# EAGLE design tactile_sensor_master_v1.1 (EAGLE 9.7.0)
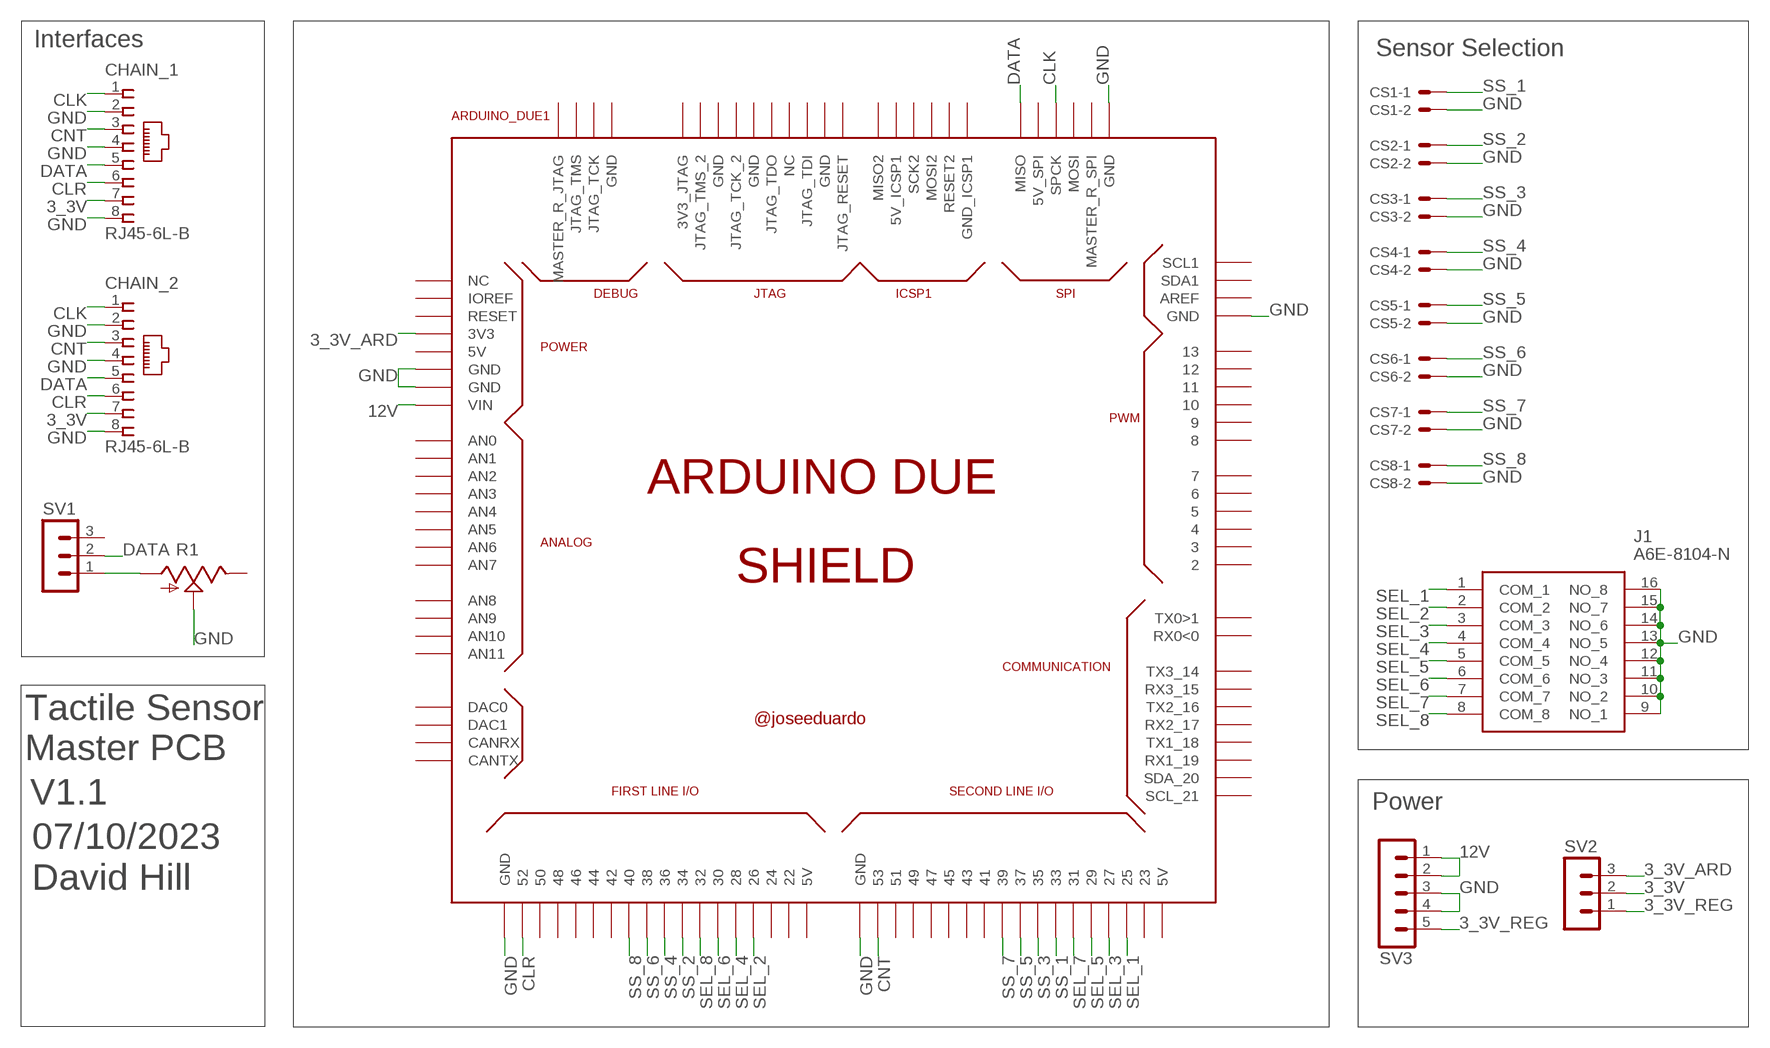
[diagram p0: schematic, sheet 1]

## Parts
ARDUINO_DUE1  ARDUINO_DUE_SHIELD  [ARDUINO_DUE_SHIELD]
CHAIN_1  RJ45-6L-B  [RJ45-NO-SHIELD]
CHAIN_2  RJ45-6L-B  [RJ45-NO-SHIELD]
CS1  22-23-2021  [22-23-2021]
CS2  22-23-2021  [22-23-2021]
CS3  22-23-2021  [22-23-2021]
CS4  22-23-2021  [22-23-2021]
CS5  22-23-2021  [22-23-2021]
CS6  22-23-2021  [22-23-2021]
CS7  22-23-2021  [22-23-2021]
CS8  22-23-2021  [22-23-2021]
J1  A6E-8104-N  [A6E8104N]
R1  TRIM_US-B25P  [B25P]
SV1  MA03-1  [MA03-1]
SV2  MA03-1  [MA03-1]
SV3  MA05-1  [MA05-1]

## Nets
3_3V: CHAIN_1.7 CHAIN_2.7 SV2.2
3_3V_ARD: ARDUINO_DUE1.3V3 SV2.3
3_3V_REG: SV2.1 SV3.5
12V: ARDUINO_DUE1.VIN SV3.1 SV3.2
CLK: ARDUINO_DUE1.SPCK CHAIN_1.1 CHAIN_2.1
CLR: ARDUINO_DUE1.52 CHAIN_1.6 CHAIN_2.6
CNT: ARDUINO_DUE1.53 CHAIN_1.3 CHAIN_2.3
DATA: ARDUINO_DUE1.MISO CHAIN_1.5 CHAIN_2.5 SV1.2
GND: ARDUINO_DUE1.GND ARDUINO_DUE1.GND_1(GND) ARDUINO_DUE1.GND_2(GND) ARDUINO_DUE1.GND_3(GND) ARDUINO_DUE1.GND_4(GND) ARDUINO_DUE1.GND_5(GND) CHAIN_1.2 CHAIN_1.4 CHAIN_1.8 CHAIN_2.2 CHAIN_2.4 CHAIN_2.8 CS1.2 CS2.2 CS3.2 CS4.2 CS5.2 CS6.2 CS7.2 CS8.2 J1.9(NO_1) J1.10(NO_2) J1.11(NO_3) J1.12(NO_4) J1.13(NO_5) J1.14(NO_6) J1.15(NO_7) J1.16(NO_8) R1.S SV3.3 SV3.4
N$1: R1.A SV1.1
SEL_1: ARDUINO_DUE1.25 J1.1(COM_1)
SEL_2: ARDUINO_DUE1.26 J1.2(COM_2)
SEL_3: ARDUINO_DUE1.27 J1.3(COM_3)
SEL_4: ARDUINO_DUE1.28 J1.4(COM_4)
SEL_5: ARDUINO_DUE1.29 J1.5(COM_5)
SEL_6: ARDUINO_DUE1.30 J1.6(COM_6)
SEL_7: ARDUINO_DUE1.31 J1.7(COM_7)
SEL_8: ARDUINO_DUE1.32 J1.8(COM_8)
SS_1: ARDUINO_DUE1.33 CS1.1
SS_2: ARDUINO_DUE1.34 CS2.1
SS_3: ARDUINO_DUE1.35 CS3.1
SS_4: ARDUINO_DUE1.36 CS4.1
SS_5: ARDUINO_DUE1.37 CS5.1
SS_6: ARDUINO_DUE1.38 CS6.1
SS_7: ARDUINO_DUE1.39 CS7.1
SS_8: ARDUINO_DUE1.40 CS8.1
Unconnected: ARDUINO_DUE1.0(RX0<0) ARDUINO_DUE1.1(TX0>1) ARDUINO_DUE1.2 ARDUINO_DUE1.3 ARDUINO_DUE1.3V3_JTAG ARDUINO_DUE1.4 ARDUINO_DUE1.5 ARDUINO_DUE1.5V0(5V) ARDUINO_DUE1.5V0_1(5V) ARDUINO_DUE1.5V0_2(5V) ARDUINO_DUE1.5V_2(5V_SPI) ARDUINO_DUE1.5V_ICSP1 ARDUINO_DUE1.6 ARDUINO_DUE1.7 ARDUINO_DUE1.8 ARDUINO_DUE1.9 ARDUINO_DUE1.10 ARDUINO_DUE1.11 ARDUINO_DUE1.12 ARDUINO_DUE1.13 ARDUINO_DUE1.14(TX3_14) ARDUINO_DUE1.15(RX3_15) ARDUINO_DUE1.16(TX2_16) ARDUINO_DUE1.17(RX2_17) ARDUINO_DUE1.18(TX1_18) ARDUINO_DUE1.19(RX1_19) ARDUINO_DUE1.20(SDA_20) ARDUINO_DUE1.21(SCL_21) ARDUINO_DUE1.22 ARDUINO_DUE1.23 ARDUINO_DUE1.24 ARDUINO_DUE1.41 ARDUINO_DUE1.42 ARDUINO_DUE1.43 ARDUINO_DUE1.44 ARDUINO_DUE1.45 ARDUINO_DUE1.46 ARDUINO_DUE1.47 ARDUINO_DUE1.48 ARDUINO_DUE1.49 ARDUINO_DUE1.50 ARDUINO_DUE1.51 ARDUINO_DUE1.A0(AN0) ARDUINO_DUE1.A1(AN1) ARDUINO_DUE1.A2(AN2) ARDUINO_DUE1.A3(AN3) ARDUINO_DUE1.A4(AN4) ARDUINO_DUE1.A5(AN5) ARDUINO_DUE1.A6(AN6) ARDUINO_DUE1.A7(AN7) ARDUINO_DUE1.A8(AN8) ARDUINO_DUE1.A9(AN9) ARDUINO_DUE1.A10(AN10) ARDUINO_DUE1.A11(AN11) ARDUINO_DUE1.AREF ARDUINO_DUE1.CANRX ARDUINO_DUE1.CANTX ARDUINO_DUE1.DAC0 ARDUINO_DUE1.DAC1 ARDUINO_DUE1.GND_7(GND) ARDUINO_DUE1.GND_8(GND) ARDUINO_DUE1.GND_9(GND) ARDUINO_DUE1.GND_10(GND) ARDUINO_DUE1.GND_ICSP1 ARDUINO_DUE1.IOREF ARDUINO_DUE1.JTAG_RESET ARDUINO_DUE1.JTAG_TCK ARDUINO_DUE1.JTAG_TCK_2 ARDUINO_DUE1.JTAG_TDI ARDUINO_DUE1.JTAG_TDO ARDUINO_DUE1.JTAG_TMS ARDUINO_DUE1.JTAG_TMS_2 ARDUINO_DUE1.MASTER_RESET_JTAG(MASTER_R_JTAG) ARDUINO_DUE1.MASTER_RESET_SPI(MASTER_R_SPI) ARDUINO_DUE1.MISO2 ARDUINO_DUE1.MOSI ARDUINO_DUE1.MOSI2 ARDUINO_DUE1.NC_2(NC) ARDUINO_DUE1.NC_5(NC) ARDUINO_DUE1.RESET ARDUINO_DUE1.RESET2 ARDUINO_DUE1.SCK2 ARDUINO_DUE1.SCL1 ARDUINO_DUE1.SDA1 R1.E SV1.3

## Notes on the sheet
- Interfaces
- Sensor Selection
- Tactile Sensor
  Master PCB
- V1.1 | Power
- 07/10/2023
- David Hill

## Library data of the parts
ARDUINO_DUE1 = arduino_due_shield:ARDUINO_DUE_SHIELD
CHAIN_1 CHAIN_2 = con-tycoelectronics:RJ45: CORCOM Modular RJ Jacks No Shield Source: www.tycoelectronics.com .. ENG_DS_1654001_1099_RJ_L_0507.pdf; MPN: RJ45-6L-B; OC_FARNELL: unknown; OC_NEWARK: 16R6090
CS1-CS8 = con-molex:22-23-2021: .100" (2.54mm) Center Header - 2 Pin; MF: MOLEX; MPN: 22-23-2021; OC_FARNELL: 1462926; OC_NEWARK: 25C3832
J1 = SamacSys_Parts:A6E-8104-N: OMRON ELECTRONIC COMPONENTS - A6E-8104-N - DIP SWITCH, 8POS, SPST, RAISED Source: Datasheet <https://www.mouser.com/datasheet/2/307/en-a6en-770042.pdf>; DESCRIPTION: OMRON ELECTRONIC COMPONENTS - A6E-8104-N - DIP SWITCH, 8POS, SPST, RAISED; HEIGHT: 7.5mm; MANUFACTURER_NAME: Omron Electronics; MANUFACTURER_PART_NUMBER: A6E-8104-N; MOUSER_PART_NUMBER: 653-A6E8104N; MOUSER_PRICE-STOCK: https://www.mouser.co.uk/ProductDetail/Omron-Electronics/A6E-8104-N?qs=vyIerDHf%2FmloJqQ30NZRaQ%3D%3D
R1 = pot:TRIM_US-: POTENTIOMETER
SV1 SV2 = con-lstb:MA03-1: PIN HEADER; OC_FARNELL: unknown; OC_NEWARK: unknown
SV3 = con-lstb:MA05-1: PIN HEADER; OC_FARNELL: unknown; OC_NEWARK: unknown

## Board
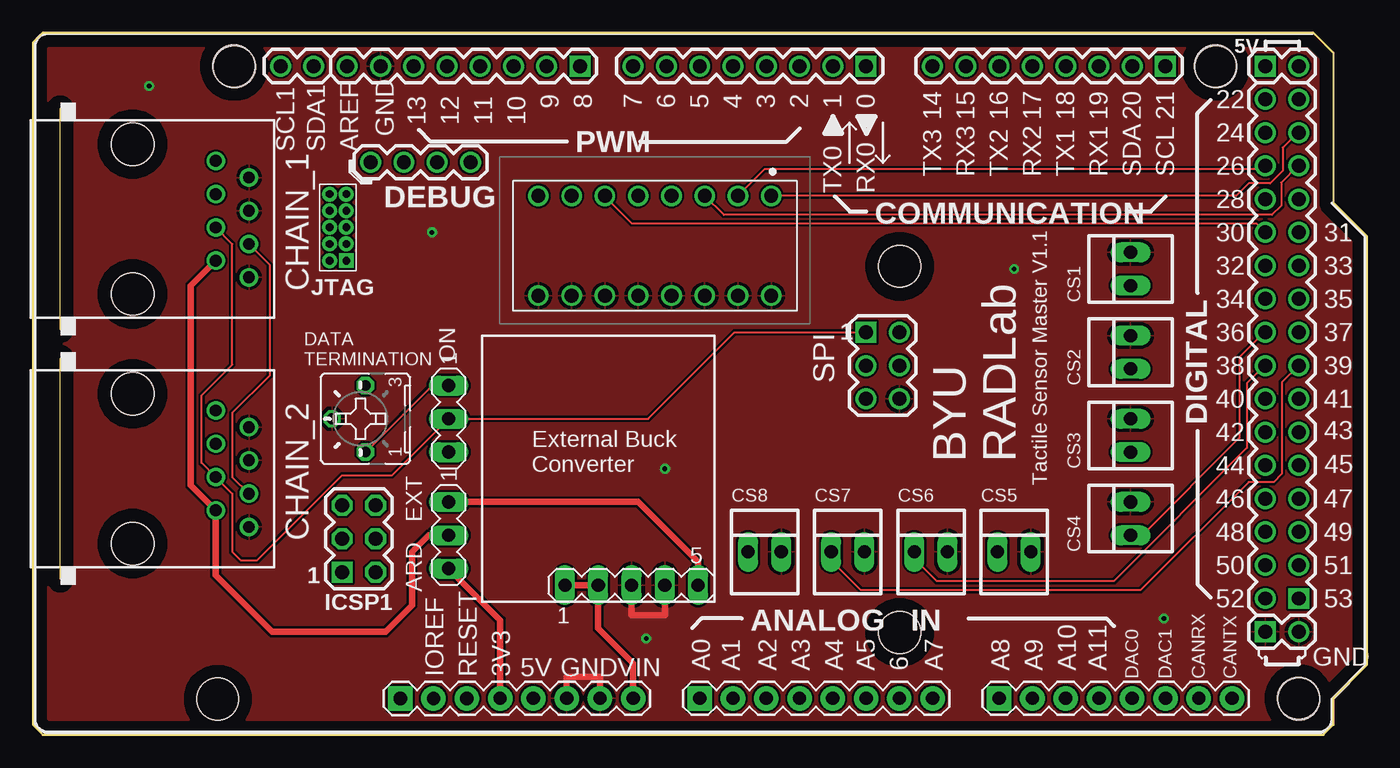
[diagram p1: board, top side]
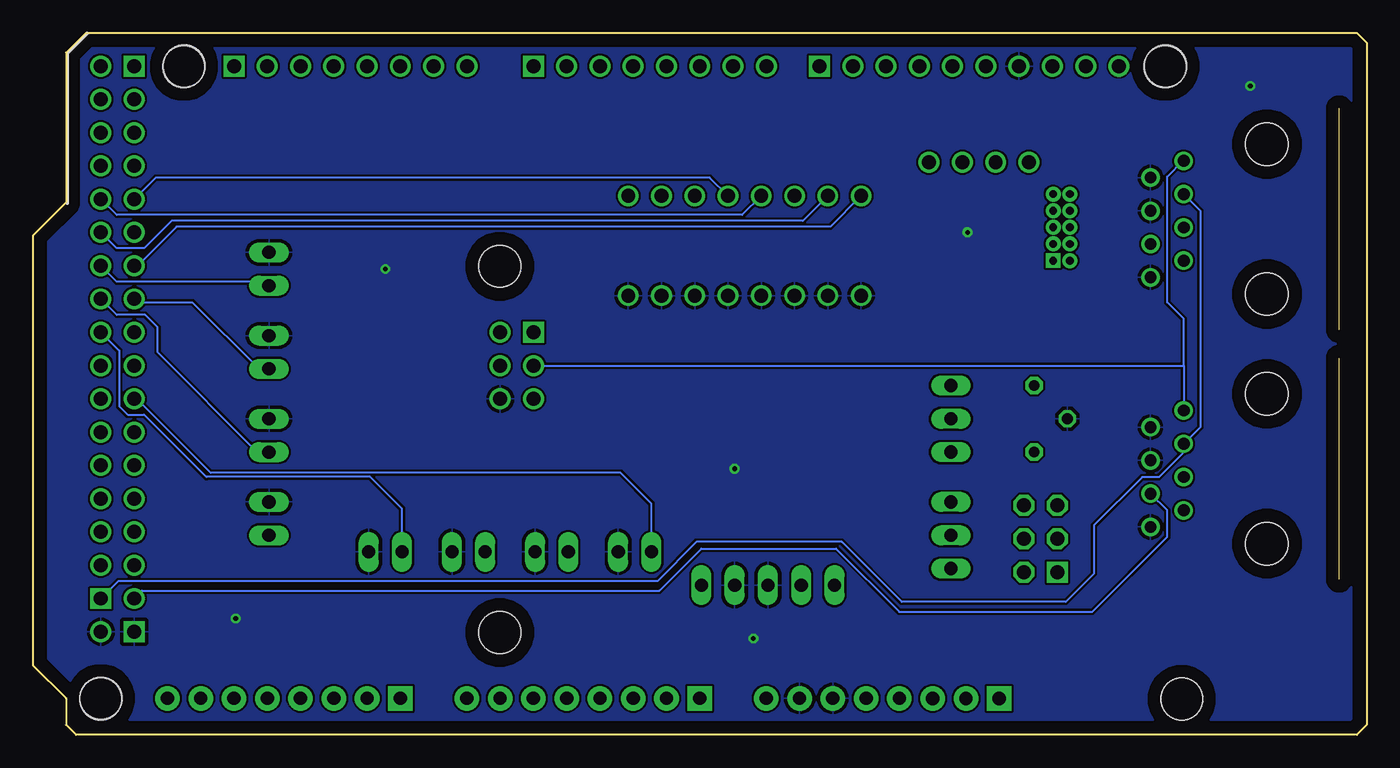
[diagram p2: board, bottom side, seen from below]

Size 101.85 x 53.59 mm. Coordinates in mm from the lower left corner, seen from the top.
Outline: 97.79,53.59 99.31,52.07 99.31,40.64 101.85,38.1 101.85,5.33 99.31,2.79 99.31,0.76 98.55,0 0.76,0 0,0.76 0,52.83 0.76,53.59 97.79,53.59
Copper layers (1*16): Top / Bottom
Stack-up Default Layer Stack: Top User Defined 0.035mm / Dielectric-1 User Defined 1.5mm / Bottom User Defined 0.035mm
Design rules "default": minimum track width 6mil, minimum drill 0.35mm, track to track 6mil, track to pad 6mil, pad to pad 6mil, via to via 6mil, smd to smd 6mil, copper to edge 40mil, drill to drill 6mil, minimum pad ring 10mil, minimum via ring 8mil, stop-mask expansion 4mil, vias tented up to drill 0mil, thermal gap 10mil

### Footprints (pad centres in the part's own frame; a part is rotated, then mirrored left to right if it is on the bottom)
ARDUINO_DUE_SHIELD = drill 1.067 square: 0 63.373,51.816; 5V0_1 93.853,51.816; 8 41.529,51.816; 21 86.233,51.816; 53 96.393,11.176; GND_2 93.853,8.636; MISO 63.373,31.496; MISO2 23.384,13.196 | drill 1.067: 1 60.833,51.816; 2 58.293,51.816; 3 55.753,51.816; 4 53.213,51.816; 5 50.673,51.816; 5V0_2 96.393,51.816; 5V_2 65.913,31.496; 6 48.133,51.816; 7 45.593,51.816; 9 38.989,51.816; 10 36.449,51.816; 11 33.909,51.816; 12 31.369,51.816; 13 28.829,51.816; 14 68.453,51.816; 15 70.993,51.816; 16 73.533,51.816; 17 76.073,51.816; 18 78.613,51.816; 19 81.153,51.816; 20 83.693,51.816; 22 93.853,49.276; 23 96.393,49.276; 24 93.853,46.736; 25 96.393,46.736; 26 93.853,44.196; 27 96.393,44.196; 28 93.853,41.656; 29 96.393,41.656; 30 93.853,39.116; 31 96.393,39.116; 32 93.853,36.576; 33 96.393,36.576; 34 93.853,34.036; 35 96.393,34.036; 36 93.853,31.496; 37 96.393,31.496; 38 93.853,28.956; 39 96.393,28.956; 40 93.853,26.416; 41 96.393,26.416; 42 93.853,23.876; 43 96.393,23.876; 44 93.853,21.336; 45 96.393,21.336; 46 93.853,18.796; 47 96.393,18.796; 48 93.853,16.256; 49 96.393,16.256; 50 93.853,13.716; 51 96.393,13.716; 52 93.853,11.176; AREF 23.749,51.816; GND_3 96.393,8.636; GND_4 26.289,51.816; GND_5 65.913,26.416; GND_7 33.161,44.473; JTAG_TCK 30.621,44.473; JTAG_TMS 28.081,44.473; MASTER_RESET_JTAG 25.541,44.473; MASTER_RESET_SPI 63.373,26.416; MOSI 65.913,28.956; SCL1 18.669,51.816; SDA1 21.209,51.816; SPCK 63.373,28.956 | drill 1.016 pad 1.88: 3V3 35.433,3.556; 5V0 37.973,3.556; A1 53.213,3.556; A2 55.753,3.556; A3 58.293,3.556; A4 60.833,3.556; A5 63.373,3.556; A6 65.913,3.556; A7 68.453,3.556; A9 76.073,3.556; A10 78.613,3.556; A11 81.153,3.556; CANRX 88.773,3.556; CANTX 91.313,3.556; DAC0 83.693,3.556; DAC1 86.233,3.556; GND 40.513,3.556; GND_1 43.053,3.556; IOREF 30.346,3.543; RESET 32.893,3.555; VIN 45.593,3.556 | drill 0.6 pad 1.016 square: 3V3_JTAG 23.689,36.964 | drill 1.067 octagon: 5V_ICSP1 25.924,13.196; GND_ICSP1 25.924,18.276; MOSI2 25.924,15.736; RESET2 23.384,18.276; SCK2 23.384,15.736 | drill 1.016 pad 1.88 square: A0 50.673,3.556; A8 73.533,3.556; NC_2 27.806,3.543 | drill 0.6 pad 1.143: GND_8 23.689,38.234; GND_9 23.689,40.774; GND_10 23.689,42.044; JTAG_RESET 22.419,42.044; JTAG_TCK_2 22.419,38.234; JTAG_TDI 22.419,40.774; JTAG_TDO 22.419,39.504; JTAG_TMS_2 22.419,36.964; NC_5 23.689,39.504 | hole 3.2: 15.113,51.816; 90.043,51.816; 96.393,3.556; 96.418,3.505; 15.138,51.765; 90.068,51.765; 13.868,3.505; 65.938,36.525; 65.938,8.585
RJ45-NO-SHIELD = drill 0.9 pad 1.4: 1 -4.445,6.35; 2 -3.175,8.89; 3 -1.905,6.35; 4 -0.635,8.89; 5 0.635,6.35; 6 1.905,8.89; 7 3.175,6.35; 8 4.445,8.89 | hole 3.251: -5.715,0; 5.715,0
22-23-2021 = drill 1 long: 1 -1.27,0; 2 1.27,0
A6E8104N = drill 1.05 pad 1.575: 1 0,0; 2 2.54,0; 3 5.08,0; 4 7.62,0; 5 10.16,0; 6 12.7,0; 7 15.24,0; 8 17.78,0; 9 17.78,7.62; 10 15.24,7.62; 11 12.7,7.62; 12 10.16,7.62; 13 7.62,7.62; 14 5.08,7.62; 15 2.54,7.62; 16 0,7.62
B25P = drill 0.813 octagon: A -2.54,0; E 2.54,0; S 0,2.54
MA03-1 = drill 1.016 long: 1 -2.54,0; 2 0,0; 3 2.54,0
MA05-1 = drill 1.016 long: 1 -5.08,0; 2 -2.54,0; 3 0,0; 4 2.54,0; 5 5.08,0

### Placement (x,y rotation side)
ARDUINO_DUE1  0.25,-0.76 0 top
CHAIN_1  7.62,39.37 270 top
CHAIN_2  7.62,20.32 270 top
CS1  83.82,35.56 90 top
CS2  83.82,29.21 90 top
CS3  83.82,22.86 90 top
CS4  83.82,16.51 90 top
CS5  74.93,13.97 0 top
CS6  68.58,13.97 0 top
CS7  62.23,13.97 0 top
CS8  55.88,13.97 0 top
J1  56.39,41.15 180 top
R1  25.4,24.13 90 top
SV1  31.75,24.13 270 top
SV2  31.75,15.24 270 top
SV3  45.72,11.43 0 top

### Tracks (layer width: path | path; a pad name or v marks a point on that pad's centre or on a via)
3_3V
  Top 0.508: CHAIN_1.7 12.06,34.29 12.06,19.05 CHAIN_2.7 13.97,12.19 18.29,7.87 26.92,7.87 28.96,9.91 28.96,13.97 30.23,15.24 SV2.2
3_3V_ARD
  Top 0.508: SV2.3 35.69,8.76 ARDUINO_DUE1.3V3
3_3V_REG
  Top 0.508: SV2.1 46.23,17.78 50.8,13.21 SV3.5
12V
  Top 0.508: SV3.1 SV3.2 43.18,8.13 45.85,5.46 ARDUINO_DUE1.VIN
CLK
  Bottom 0.152: 13.97,28.19 CHAIN_2.1 | CHAIN_1.1 14.03,43.81 15.24,42.61 15.24,33.02 13.97,31.75 13.97,28.19 | ARDUINO_DUE1.SPCK 13.97,28.19
CLR
  Top 0.152: CHAIN_2.6 15.24,19.68 15.24,24.57 18.1,27.43 18.1,35.88 CHAIN_1.6
  Bottom 0.152: CHAIN_2.6 15.24,17.14 15.24,15.11 20.95,9.4 35.68,9.4 40.51,14.22 50.8,14.22 54,11.02 93.5,11.02 ARDUINO_DUE1.52
CNT
  Bottom 0.152: CHAIN_1.3 12.7,40.01 12.7,23.5 CHAIN_2.3 13.97,21.59 15.88,19.68 17.14,19.68 20.83,16 20.83,12.32 22.99,10.16 35.51,10.16 40.08,14.73 51.18,14.73 54.17,11.75 95.31,11.75 ARDUINO_DUE1.53
DATA
  Top 0.152: CHAIN_1.5 15.24,37.47 15.24,28.26 12.89,25.91 12.89,20.77 CHAIN_2.5 15.24,18.41 15.24,13.97 15.88,13.34 17.14,13.34 23.62,19.81 27.43,19.81 SV1.2 46.99,24.13 53.59,30.73 ARDUINO_DUE1.MISO
GND  (via drill 0.35)
  Top 0.152: 22.86,23.5 R1.S
  Top 0.508: SV3.3 45.72,9.14 48.26,9.14 SV3.4 | ARDUINO_DUE1.GND 40.77,4.45 43.31,4.45 ARDUINO_DUE1.GND_1
  other vias: 86.36,8.89 48.26,20.32 74.93,35.56 30.48,38.35 8.89,49.53 46.84,7.36
  pour Top: 102.95,54.69 -1.35,54.69 -1.35,-1.35 102.95,-1.35
  pour Bottom: 102.95,54.69 -1.35,54.69 -1.35,-1.35 102.95,-1.35
N$1
  Top 0.152: R1.A 30.48,26.67 SV1.1
SEL_1
  Top 0.152: J1.1 91.89,41.15 92.84,42.1 94.49,42.1 95.44,43.05 95.44,44.83 96.58,45.97 ARDUINO_DUE1.25
SEL_2
  Top 0.152: J1.2 55.88,43.18 93.98,43.18 ARDUINO_DUE1.26
SEL_3
  Top 0.152: J1.3 52.77,39.69 94.61,39.69 95.31,40.39 95.31,42.16 96.58,43.43 ARDUINO_DUE1.27
SEL_4
  Bottom 0.152: J1.4 50.16,42.55 92.46,42.55 ARDUINO_DUE1.28
SEL_5
  Bottom 0.152: J1.5 47.69,39.69 95.44,39.69 ARDUINO_DUE1.29
SEL_6
  Top 0.152: J1.6 43.69,41.08 45.72,39.05 93.41,39.05 ARDUINO_DUE1.30
SEL_7
  Bottom 0.152: J1.7 43.05,39.24 91.25,39.24 93.34,37.15 95.44,37.15 ARDUINO_DUE1.31
SEL_8
  Bottom 0.152: J1.8 40.96,38.8 90.87,38.8 93.85,35.81 ARDUINO_DUE1.32
SS_1
  Bottom 0.152: CS1.1 84.14,34.61 95.44,34.61 ARDUINO_DUE1.33
SS_2
  Bottom 0.152: CS2.1 84.58,27.94 89.66,33.02 93.85,33.02 ARDUINO_DUE1.34
SS_3
  Bottom 0.152: CS3.1 84.71,21.59 92.33,29.21 92.33,31.11 93.28,32.07 95.44,32.07 ARDUINO_DUE1.35
SS_4
  Top 0.152: CS4.1 84.71,15.24 92.14,22.67 92.14,28.83 94.04,30.73 ARDUINO_DUE1.36
SS_5
  Bottom 0.152: ARDUINO_DUE1.37 95.25,29.34 95.25,25.08 94.61,24.45 93.34,24.45 88.58,19.68 88.57,19.7 76.09,19.7 73.66,17.27 CS5.1
SS_6
  Top 0.152: CS6.1 67.31,13.46 69.03,11.75 82.55,11.75 92.71,21.91 92.71,26.86 94.04,28.19 ARDUINO_DUE1.38
SS_7
  Top 0.152: ARDUINO_DUE1.39 95.38,26.92 95.38,19.94 94.74,19.3 92.84,19.3 84.58,11.05 63.25,11.05 60.96,13.34 CS7.1
SS_8
  Bottom 0.152: ARDUINO_DUE1.40 93.92,25.65 88.27,20 56.96,20 54.61,17.65 CS8.1

### Text on the board
tNames: DATA / TERMINATION | ON | BYU / RADLab | External Buck / Converter | Tactile Sensor Master V1.1 | EXT | ARD